# EAGLE design bs_usb (EAGLE 9.2.0)
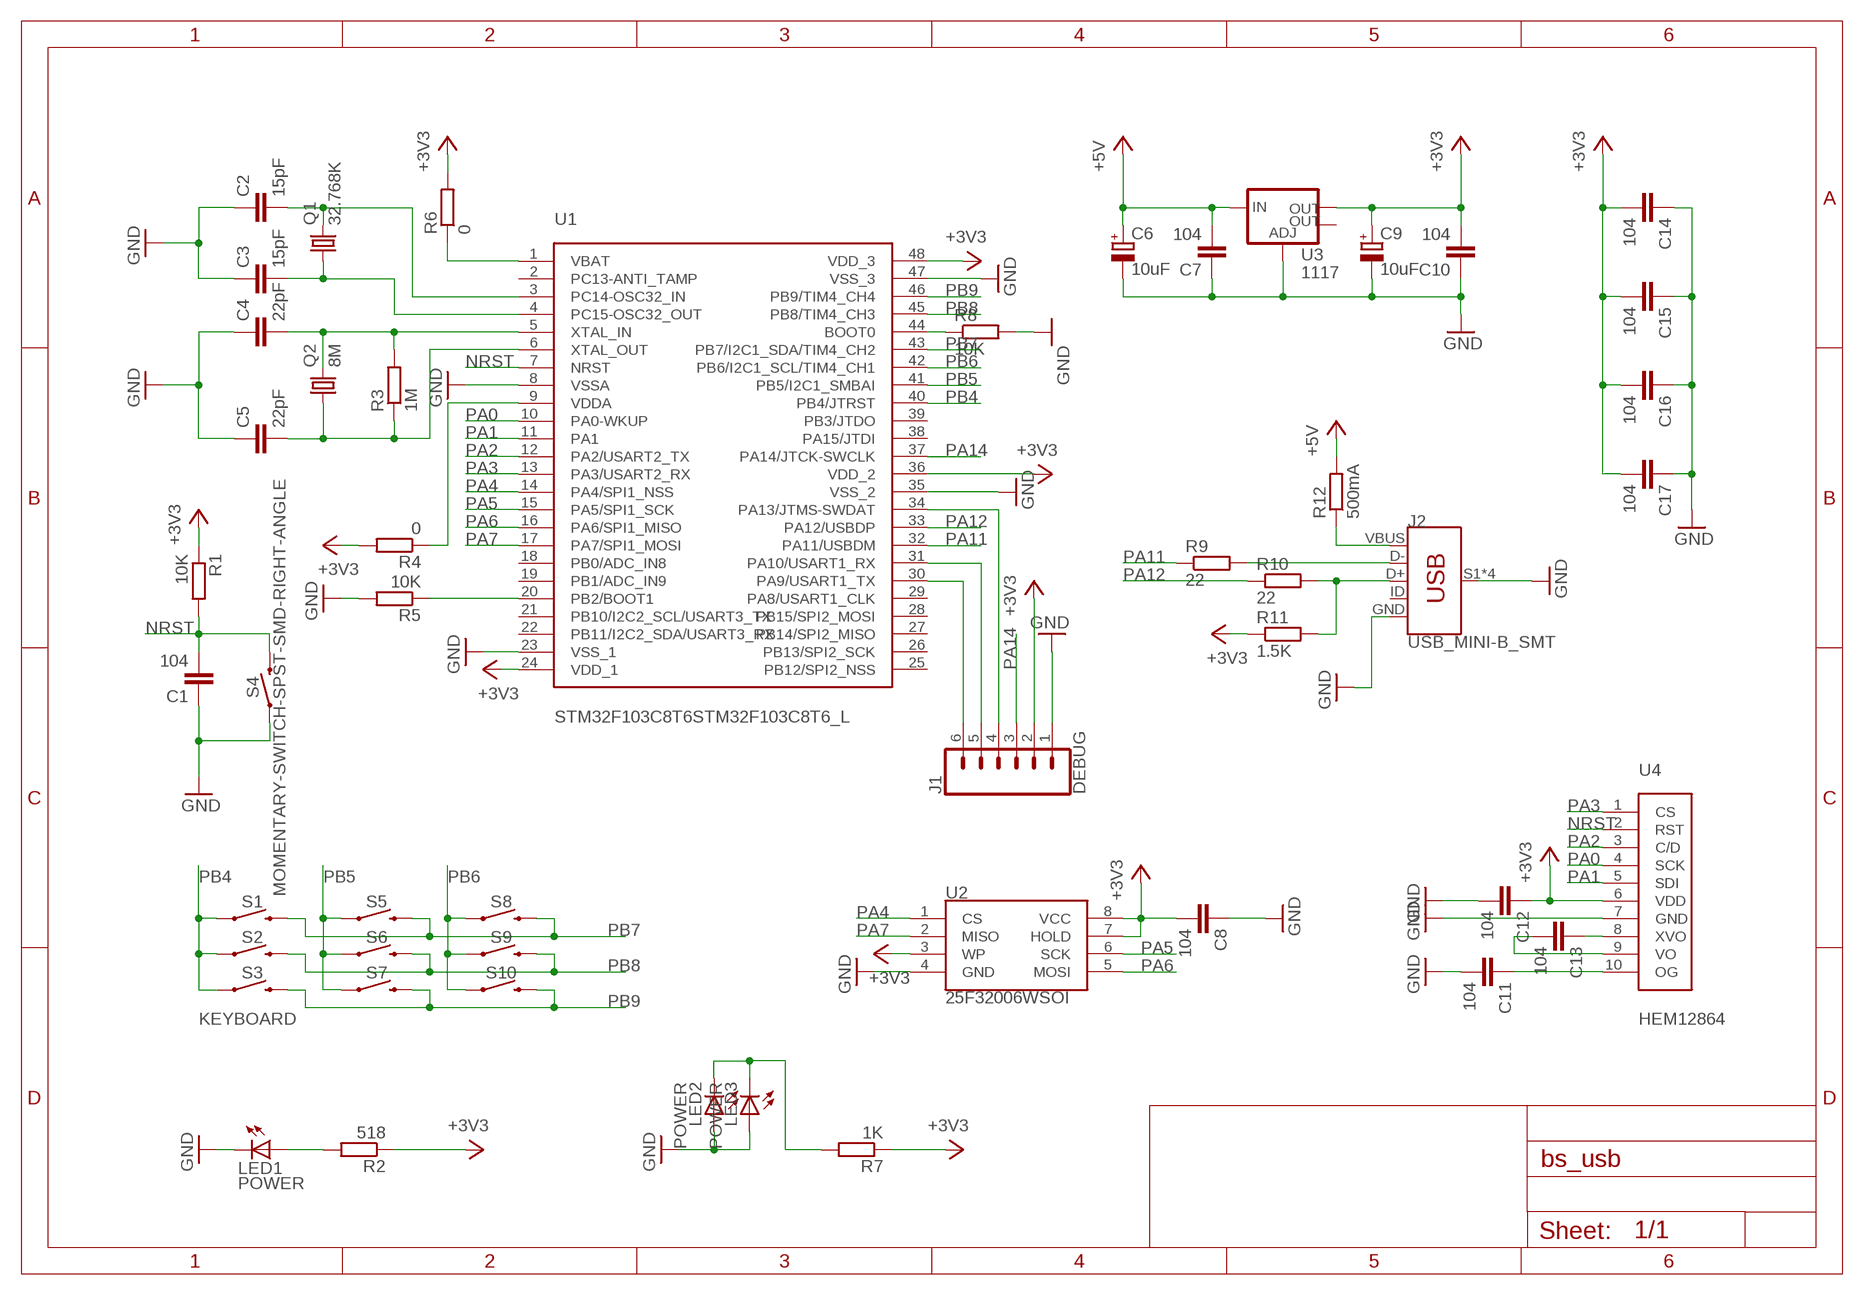
[diagram p0: schematic, sheet 1]

## Parts
C1  104  C-EUC0603  [C0603]
C2  15pF  C-EUC0603  [C0603]
C3  15pF  C-EUC0603  [C0603]
C4  22pF  C-EUC0603  [C0603]
C5  22pF  C-EUC0603  [C0603]
C6  10uF  CPOL-EUA/3216-18R  [A/3216-18R]
C7  104  C-EUC0603  [C0603]
C8  104  C-EUC0603  [C0603]
C9  10uF  CPOL-EUA/3216-18R  [A/3216-18R]
C10  104  C-EUC0603  [C0603]
C11  104  C-EUC0603  [C0603]
C12  104  C-EUC0603  [C0603]
C13  104  C-EUC0603  [C0603]
C14  104  C-EUC0603  [C0603]
C15  104  C-EUC0603  [C0603]
C16  104  C-EUC0603  [C0603]
C17  104  C-EUC0603  [C0603]
J1  DEBUG  CONN_06NO_SILK_FEMALE_PTH  [1X06_NO_SILK]
J2  USB_MINI-B_SMT  [USB-MINIB]
LED1  POWER  LEDCHIP-LED0805  [CHIP-LED0805]
LED2  POWER  LEDCHIP-LED0805  [CHIP-LED0805]
LED3  POWER  LEDCHIP-LED0805  [CHIP-LED0805]
Q1  32.768K  CRYSTALTC26H  [TC26H]
Q2  8M  CRYSTALSM49  [SM49]
R1  10K  R-EU_R0603  [R0603]
R2  518  R-EU_R0603  [R0603]
R3  1M  R-EU_R0603  [R0603]
R4  0  R-EU_R0603  [R0603]
R5  10K  R-EU_R0603  [R0603]
R6  0  R-EU_R0603  [R0603]
R7  1K  R-EU_R0603  [R0603]
R8  10K  R-EU_R0603  [R0603]
R9  22  R-EU_R0603  [R0603]
R10  22  R-EU_R0603  [R0603]
R11  1.5K  R-EU_R0603  [R0603]
R12  500mA  R-EU_R0603  [R0603]
S1  MOMENTARY-SWITCH-SPST-PTH-6.0MM  [TACTILE_SWITCH_PTH_6.0MM]
S2  MOMENTARY-SWITCH-SPST-PTH-6.0MM  [TACTILE_SWITCH_PTH_6.0MM]
S3  MOMENTARY-SWITCH-SPST-PTH-6.0MM  [TACTILE_SWITCH_PTH_6.0MM]
S4  MOMENTARY-SWITCH-SPST-SMD-RIGHT-ANGLE  [TACTILE_SWITCH_SMD_RIGHT_ANGLE]
S5  MOMENTARY-SWITCH-SPST-PTH-6.0MM  [TACTILE_SWITCH_PTH_6.0MM]
S6  MOMENTARY-SWITCH-SPST-PTH-6.0MM  [TACTILE_SWITCH_PTH_6.0MM]
S7  MOMENTARY-SWITCH-SPST-PTH-6.0MM  [TACTILE_SWITCH_PTH_6.0MM]
S8  MOMENTARY-SWITCH-SPST-PTH-6.0MM  [TACTILE_SWITCH_PTH_6.0MM]
S9  MOMENTARY-SWITCH-SPST-PTH-6.0MM  [TACTILE_SWITCH_PTH_6.0MM]
S10  MOMENTARY-SWITCH-SPST-PTH-6.0MM  [TACTILE_SWITCH_PTH_6.0MM]
U1  STM32F103C8T6STM32F103C8T6_L  [TQFP48_7X7]
U2  25F32006WSOI  SPI_FLASH-X25XXSMD1  [SO08-EIAJ]
U3  1117  V_REG_LM1117SOT223  [SOT223]
U4  HEM12864  [HEM12864]

## Nets
+3V3: C8.2 C9.+ C10.2 C12.1 C14.2 C15.2 C16.2 C17.2 J1.2 R1.1 R2.1 R4.2 R6.2 R7.1 R11.1 U1.24(VDD_1) U1.36(VDD_2) U1.48(VDD_3) U2.3(WP) U2.7(HOLD) U2.8(VCC) U3.2(OUT) U4.6(VDD)
+5V: C6.+ C7.2 R12.2 U3.3(IN)
GND: C1.1 C2.1 C3.1 C4.1 C5.1 C6.- C7.1 C8.1 C9.- C10.1 C11.2 C12.2 C14.1 C15.1 C16.1 C17.1 J1.1 J2.GND J2.S1(SHIELD) J2.S2(SHIELD) J2.S3(SHIELD) J2.S4(SHIELD) LED1.C LED2.A LED3.A R5.2 R8.2 S4.1 U1.8(VSSA) U1.23(VSS_1) U1.35(VSS_2) U1.47(VSS_3) U2.4(GND) U3.1(ADJ) U4.7(GND)
N$1: R8.1 U1.44(BOOT0)
N$2: R6.1 U1.1(VBAT)
N$3: R5.1 U1.20(PB2/BOOT1)
N$4: R4.1 U1.9(VDDA)
N$5: C4.2 Q2.2 R3.2 U1.5(XTAL_IN)
N$6: C2.2 Q1.2 U1.3(PC14-OSC32_IN)
N$7: C5.2 Q2.1 R3.1 U1.6(XTAL_OUT)
N$8: C3.2 Q1.1 U1.4(PC15-OSC32_OUT)
N$9: J2.D- R9.2
N$10: J2.D+ R10.2 R11.2
N$11: J2.VBUS R12.1
N$12: J1.6 U1.30(PA9/USART1_TX)
N$13: J1.5 U1.31(PA10/USART1_RX)
N$14: C13.1 U4.8(XVO)
N$15: C13.2 U4.9(VO)
N$16: C11.1 U4.10(OG)
N$18: LED2.C LED3.C R7.2
N$19: LED1.A R2.2
NRST: C1.2 R1.2 S4.2 U1.7(NRST) U4.2(RST)
PA0: U1.10(PA0-WKUP) U4.4(SCK)
PA1: U1.11(PA1) U4.5(SDI)
PA2: U1.12(PA2/USART2_TX) U4.3(C/D)
PA3: U1.13(PA3/USART2_RX) U4.1(CS)
PA4: U1.14(PA4/SPI1_NSS) U2.1(CS)
PA5: U1.15(PA5/SPI1_SCK) U2.6(SCK)
PA6: U1.16(PA6/SPI1_MISO) U2.5(MOSI)
PA7: U1.17(PA7/SPI1_MOSI) U2.2(MISO)
PA11: R9.1 U1.32(PA11/USBDM)
PA12: R10.1 U1.33(PA12/USBDP)
PA13: J1.4 U1.34(PA13/JTMS-SWDAT)
PA14: J1.3 U1.37(PA14/JTCK-SWCLK)
PB4: S1.1 S2.1 S3.1 U1.40(PB4/JTRST)
PB5: S5.1 S6.1 S7.1 U1.41(PB5/I2C1_SMBAI)
PB6: S8.1 S9.1 S10.1 U1.42(PB6/I2C1_SCL/TIM4_CH1)
PB7: S1.3 S5.3 S8.3 U1.43(PB7/I2C1_SDA/TIM4_CH2)
PB8: S2.3 S6.3 S9.3 U1.45(PB8/TIM4_CH3)
PB9: S3.3 S7.3 S10.3 U1.46(PB9/TIM4_CH4)
Unconnected: J2.ID U1.2(PC13-ANTI_TAMP) U1.18(PB0/ADC_IN8) U1.19(PB1/ADC_IN9) U1.21(PB10/I2C2_SCL/USART3_TX) U1.22(PB11/I2C2_SDA/USART3_RX) U1.25(PB12/SPI2_NSS) U1.26(PB13/SPI2_SCK) U1.27(PB14/SPI2_MISO) U1.28(PB15/SPI2_MOSI) U1.29(PA8/USART1_CLK) U1.38(PA15/JTDI) U1.39(PB3/JTDO) U3.4(OUT)

## Notes on the sheet
- KEYBOARD

## Library data of the parts
C1-C5 C7 C8 C10-C17 = rcl:C-EU: CAPACITOR, European symbol; SPICEPREFIX: C
C6 C9 = rcl:CPOL-EU: POLARIZED CAPACITOR, European symbol; SPICEPREFIX: C
J1 = SparkFun-Connectors:CONN_06: Multi connection point. Often used as Generic Header-pin footprint for 0.1 inch spaced/style header connections On any of the 0.1 inch spaced packages, you can populate with these: Break Away Headers - Straight <https://www.sparkfun.com/products/116> (PRT-00116) Break Away Male Headers - Right Angle <https://www.sparkfun.com/products/553> (PRT-00553) Female Headers <https://www.sparkfun.com/products/115> (PRT-00115) Break Away Headers - Machine Pin <https://www.sparkfun.com/products/117> (PRT-00117) Break Away Female Headers - Swiss Machine Pin <https://www.sparkfun.com/products/743> (PRT-00743) Arduino Stackable Header - 6 Pin <https://www.sparkfun.com/products/9280> (PRT-09280) For SCREWTERMINALS and SPRING TERMINALS visit here: Screw Terimnals on SparkFun.com <https://www.sparkfun.com/search/results?term=Screw+Terminals> (5mm/3.5mm/2.54mm spacing) This device is also useful as a general connection point to wire up your design to another part of your project. Our various solder wires solder well into these plated through hole pads. Hook-Up Wire - Assortment (Stranded, 22 AWG) <https://www.sparkfun.com/products/11375> (PRT-11375) Hook-Up Wire - Assortment (Solid Core, 22 AWG) <https://www.sparkfun.com/products/11367> (PRT-11367) View the entire wire category on our website here <https://www.sparkfun.com/categories/141>; PROD_ID: CONN-08437
J2 = SparkFun-Connectors:USB_MINI-B: USB type Mini-B Connector Breaks out 5th pin, and includes shield pins if needed. SparkFun Products: SparkFun FTDI Basic Breakout <https://www.sparkfun.com/products/9716> SparkFun XBee Explorer USB <https://www.sparkfun.com/products/11812> SparkFun Redboard <https://www.sparkfun.com/products/12757>; PROD_ID: CONN-08193; SF_ID: PRT-00587
LED1-LED3 = led:LED: LED OSRAM: - CHIPLED LG R971, LG N971, LY N971, LG Q971, LY Q971, LO R971, LY R971 LH N974, LH R974 LS Q976, LO Q976, LY Q976 LO Q996 - Hyper CHIPLED LW Q18S LB Q993, LB Q99A, LB R99A - SideLED LS A670, LO A670, LY A670, LG A670, LP A670 LB A673, LV A673, LT A673, LW A673 LH A674 LY A675 LS A676, LA A676, LO A676, LY A676, LW A676 LS A679, LY A679, LG A679 - Hyper Micro SIDELED® LS Y876, LA Y876, LO Y876, LY Y876 LT Y87S - SmartLED LW L88C, LW L88S LB L89C, LB L89S, LG L890 LS L89K, LO L89K, LY L89K LS L896, LA L896, LO L896, LY L896 - TOPLED LS T670, LO T670, LY T670, LG T670, LP T670 LSG T670, LSP T670, LSY T670, LOP T670, LYG T670 LG T671, LOG T671, LSG T671 LB T673, LV T673, LT T673, LW T673 LH T674 LS T676, LA T676, LO T676, LY T676, LB T676, LH T676, LSB T676, LW T676 LB T67C, LV T67C, LT T67C, LS T67K, LO T67K, LY T67K, LW E67C LS E67B, LA E67B, LO E67B, LY E67B, LB E67C, LV E67C, LT E67C LW T67C LS T679, LY T679, LG T679 LS T770, LO T770, LY T770, LG T770, LP T770 LB T773, LV T773, LT T773, LW T773 LH T774 LS E675, LA E675, LY E675, LS T675 LS T776, LA T776, LO T776, LY T776, LB T776 LHGB T686 LT T68C, LB T68C - Hyper Mini TOPLED® LB M676 - Mini TOPLED Santana® LG M470 LS M47K, LO M47K, LY M47K Source: http://www.osram.convergy.de LUXEON: - LUMILED® LXK2-PW12-R00, LXK2-PW12-S00, LXK2-PW14-U00, LXK2-PW14-V00 LXK2-PM12-R00, LXK2-PM12-S00, LXK2-PM14-U00 LXK2-PE12-Q00, LXK2-PE12-R00, LXK2-PE12-S00, LXK2-PE14-T00, LXK2-PE14-U00 LXK2-PB12-K00, LXK2-PB12-L00, LXK2-PB12-M00, LXK2-PB14-N00, LXK2-PB14-P00, LXK2-PB14-Q00 LXK2-PR12-L00, LXK2-PR12-M00, LXK2-PR14-Q00, LXK2-PR14-R00 LXK2-PD12-Q00, LXK2-PD12-R00, LXK2-PD12-S00 LXK2-PH12-R00, LXK2-PH12-S00 LXK2-PL12-P00, LXK2-PL12-Q00, LXK2-PL12-R00 Source: www.luxeon.com KINGBRIGHT: KA-3528ASYC Source: www.kingbright.com
Q1 Q2 = crystal:CRYSTAL: CRYSTAL; OC_FARNELL: unknown; OC_NEWARK: unknown
R1-R12 = rcl:R-EU_: RESISTOR, European symbol; SPICEPREFIX: R
S1-S3 S5-S10 = SparkFun-Switches:MOMENTARY-SWITCH-SPST: Momentary Switch (Pushbutton) - SPST Normally-open (NO) SPST momentary switches (buttons, pushbuttons). Variants PTH-12MM - 12mm square, through-hole Momentary Pushbutton Switch - 12mm Square <https://www.sparkfun.com/products/9190> (COM-09190) PTH-6.0MM, PTH-6.0MM-KIT - 6.0mm square, through-hole Mini Pushbutton Switch <https://www.sparkfun.com/products/97> (COM-00097) KIT package intended for soldering kit's - only one side of pads' copper is exposed. PTH-RIGHT-ANGLE-KIT - Right-angle, through-hole Right Angle Tactile Button <https://www.sparkfun.com/products/10791> - Used on SparkFun BigTime Watch Kit <https://www.sparkfun.com/products/11734> SMD-12MM - 12mm square, surface-mount Tactile Button - SMD (12mm) <https://www.sparkfun.com/products/12993> (COM-12993) Used on SparkFun PicoBoard <https://www.sparkfun.com/products/11888> SMD-4.5MM - 4.5mm Square Trackball Switch Used on SparkFun Blackberry Trackballer Breakout <https://www.sparkfun.com/products/13169> SMD-4.6MMX2.8MM - 4.60mm x 2.80mm, surface mount Used on SparkFun SAMD21 Mini Breakout <https://www.sparkfun.com/products/13664> SMD-5.2MM, SMD-5.2-REDUNDANT - 5.2mm square, surface-mount Mini Pushbutton Switch - SMD <https://www.sparkfun.com/products/8720> (COM-08720) Used on Arduino Pro Mini <https://www.sparkfun.com/products/11114> REDUNDANT package connects both switch circuits together SMD-6.0X3.5MM - 6.0 x 3.5mm, surface mount Momentary Reset Switch SMD <https://www.sparkfun.com/products/8229> (COM-08229) SMD-6.2MM-TALL - 6.2mm square, surface mount Tactile Button - SMD (6mm) <https://www.sparkfun.com/products/12992> Used on SparkFun Digital Sandbox <https://www.sparkfun.com/products/12651> SMD-RIGHT-ANGLE - Right-angle, surface mount Used on SparkFun Block for Intel® Edison - Arduino <https://www.sparkfun.com/products/13036>; PROD_ID: SWCH-08441; SF_SKU: COM-00097
S4 = SparkFun-Switches:MOMENTARY-SWITCH-SPST: Momentary Switch (Pushbutton) - SPST Normally-open (NO) SPST momentary switches (buttons, pushbuttons). Variants PTH-12MM - 12mm square, through-hole Momentary Pushbutton Switch - 12mm Square <https://www.sparkfun.com/products/9190> (COM-09190) PTH-6.0MM, PTH-6.0MM-KIT - 6.0mm square, through-hole Mini Pushbutton Switch <https://www.sparkfun.com/products/97> (COM-00097) KIT package intended for soldering kit's - only one side of pads' copper is exposed. PTH-RIGHT-ANGLE-KIT - Right-angle, through-hole Right Angle Tactile Button <https://www.sparkfun.com/products/10791> - Used on SparkFun BigTime Watch Kit <https://www.sparkfun.com/products/11734> SMD-12MM - 12mm square, surface-mount Tactile Button - SMD (12mm) <https://www.sparkfun.com/products/12993> (COM-12993) Used on SparkFun PicoBoard <https://www.sparkfun.com/products/11888> SMD-4.5MM - 4.5mm Square Trackball Switch Used on SparkFun Blackberry Trackballer Breakout <https://www.sparkfun.com/products/13169> SMD-4.6MMX2.8MM - 4.60mm x 2.80mm, surface mount Used on SparkFun SAMD21 Mini Breakout <https://www.sparkfun.com/products/13664> SMD-5.2MM, SMD-5.2-REDUNDANT - 5.2mm square, surface-mount Mini Pushbutton Switch - SMD <https://www.sparkfun.com/products/8720> (COM-08720) Used on Arduino Pro Mini <https://www.sparkfun.com/products/11114> REDUNDANT package connects both switch circuits together SMD-6.0X3.5MM - 6.0 x 3.5mm, surface mount Momentary Reset Switch SMD <https://www.sparkfun.com/products/8229> (COM-08229) SMD-6.2MM-TALL - 6.2mm square, surface mount Tactile Button - SMD (6mm) <https://www.sparkfun.com/products/12992> Used on SparkFun Digital Sandbox <https://www.sparkfun.com/products/12651> SMD-RIGHT-ANGLE - Right-angle, surface mount Used on SparkFun Block for Intel® Edison - Arduino <https://www.sparkfun.com/products/13036>; PROD_ID: COMP-12265
U1 = bs_usb:STM32F103C8T6: STM32F103C8T6
U2 = SparkFun-IC-Memory:SPI_FLASH-X25XX: 32M Serial Flash Memory 8pin SPI Flash series x25xx. Works with devices like W25X32 and BR25L32 Datasheet <http://www.macronix.com/Lists/Datasheet/Attachments/5031/MX25L3206E,%203V,%2032Mb,%20v1.5.pdf> SparkFun Products SparkFun Venus GPS Logger <https://www.sparkfun.com/products/10920> (GPS-10920); PROD_ID: IC-09109
U3 = SparkFun-IC-Power:V_REG_LM1117: Voltage Regulator LM1117 Standard adjustable voltage regulator but in SMD form. Spark Fun Electronics SKU : COM-00595; PROD_ID: VREG-08170
U4 = bs_usb:HEM12864: HEM12864

## Board
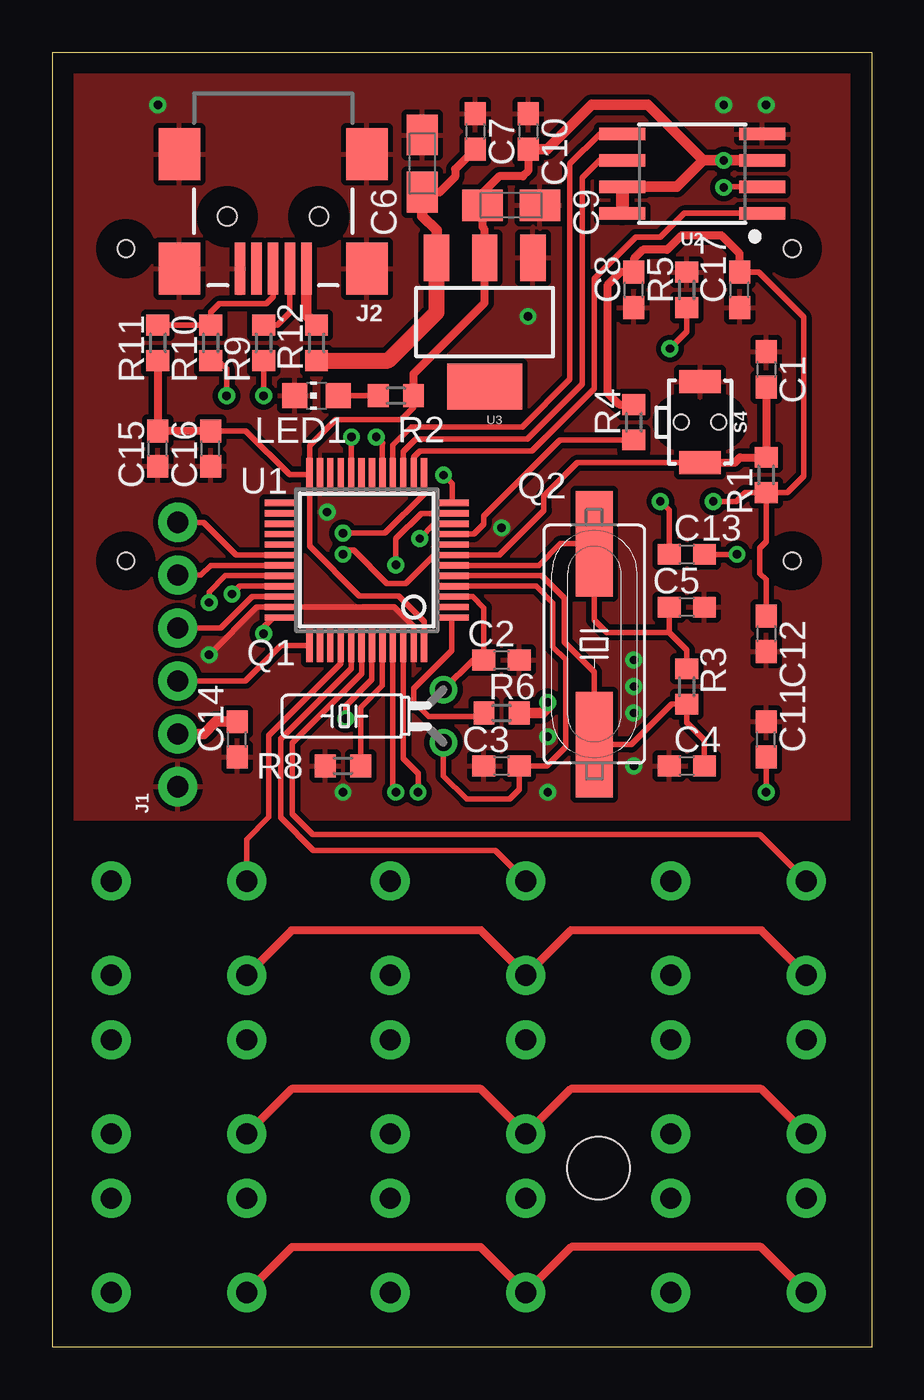
[diagram p1: board, top side]
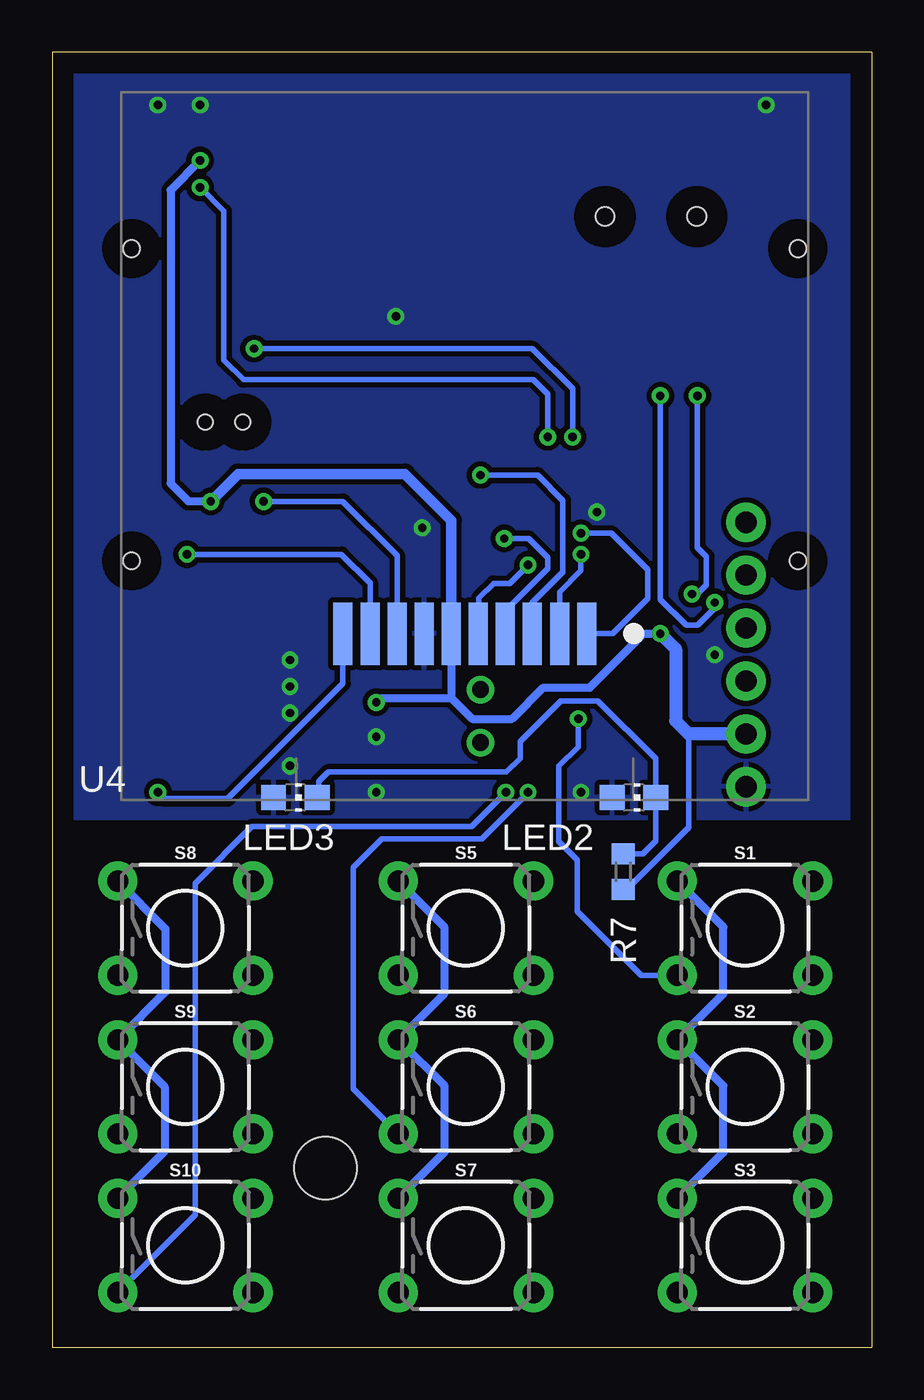
[diagram p2: board, bottom side, seen from below]

Size 39.37 x 62.23 mm. Coordinates in mm from the lower left corner, seen from the top.
Outline: 0,62.23 39.37,62.23 39.37,0 0,0 0,62.23
Copper layers (1*16): Top 0.035mm / dielectric 1.5mm / Bottom 0.035mm
Design rules "default": minimum track width 6mil, minimum drill 0.35mm, track to track 6mil, track to pad 6mil, pad to pad 6mil, via to via 6mil, smd to smd 6mil, copper to edge 40mil, drill to drill 6mil, minimum pad ring 10mil, minimum via ring 8mil, stop-mask expansion 4mil, vias tented up to drill 0mil, thermal gap 10mil
Holes 3 mm at 26.24,8.61

### Footprints (pad centres in the part's own frame; a part is rotated, then mirrored left to right if it is on the bottom)
C0603 = smd 1.1 x 1: 1 -0.85,0; 2 0.85,0
A/3216-18R = smd 1.95 x 1.5: + 1.375,0; - -1.375,0
1X06_NO_SILK = drill 1.016 pad 1.88: 1 0,0; 2 2.54,0; 3 5.08,0; 4 7.62,0; 5 10.16,0; 6 12.7,0
USB-MINIB = smd 2.5 x 0.5: D+ 2.5,0; D- 2.5,0.8; GND 2.5,-1.6; ID 2.5,-0.8; VBUS 2.5,1.6 | smd 2.5 x 2: S1 -3,4.5; S2 2.5,4.5; S3 -3,-4.5; S4 2.5,-4.5 | hole 0.9: 0,2.2; 0,-2.2
CHIP-LED0805 = smd 1.2 x 1.2: A 0,-1.05; C 0,1.05
TC26H = drill 0.813: 1 -1.27,0; 2 1.27,0
SM49 = smd 5.08 x 1.778: 1 -4.826,0; 2 4.826,0
R0603 = smd 1 x 1.1: 1 -0.85,0; 2 0.85,0
TACTILE_SWITCH_PTH_6.0MM = drill 1.016 pad 1.88: 1 -3.251,2.261; 2 3.251,2.261; 3 -3.251,-2.261; 4 3.251,-2.261
TACTILE_SWITCH_SMD_RIGHT_ANGLE = smd 1.1 x 2: 1 -1.95,0; 2 1.95,0 | hole 0.7: 0,0.9; 0,-0.9
TQFP48_7X7 = smd 0.3 x 1.6: 1 -2.75,-4.1; 2 -2.25,-4.1; 3 -1.75,-4.1; 4 -1.25,-4.1; 5 -0.75,-4.1; 6 -0.25,-4.1; 7 0.25,-4.1; 8 0.75,-4.1; 9 1.25,-4.1; 10 1.75,-4.1; 11 2.25,-4.1; 12 2.75,-4.1; 25 2.75,4.1; 26 2.25,4.1; 27 1.75,4.1; 28 1.25,4.1; 29 0.75,4.1; 30 0.25,4.1; 31 -0.25,4.1; 32 -0.75,4.1; 33 -1.25,4.1; 34 -1.75,4.1; 35 -2.25,4.1; 36 -2.75,4.1 | smd 1.6 x 0.3: 13 4.1,-2.75; 14 4.1,-2.25; 15 4.1,-1.75; 16 4.1,-1.25; 17 4.1,-0.75; 18 4.1,-0.25; 19 4.1,0.25; 20 4.1,0.75; 21 4.1,1.25; 22 4.1,1.75; 23 4.1,2.25; 24 4.1,2.75; 37 -4.1,2.75; 38 -4.1,2.25; 39 -4.1,1.75; 40 -4.1,1.25; 41 -4.1,0.75; 42 -4.1,0.25; 43 -4.1,-0.25; 44 -4.1,-0.75; 45 -4.1,-1.25; 46 -4.1,-1.75; 47 -4.1,-2.25; 48 -4.1,-2.75
SO08-EIAJ = smd 0.61 x 2.21: 1 -1.905,-3.378; 2 -0.635,-3.378; 3 0.635,-3.378; 4 1.905,-3.378; 5 1.905,3.353; 6 0.635,3.353; 7 -0.635,3.353; 8 -1.905,3.353
SOT223 = smd 1.219 x 2.235: 1 -2.311,-3.099; 2 0,-3.099; 3 2.311,-3.099 | smd 3.6 x 2.2: 4 0,3.099
HEM12864 = smd 0.914 x 2.997: 1 11.7,0; 2 10.4,0; 3 9.1,0; 4 7.8,0; 5 6.5,0; 6 5.2,0; 7 3.9,0; 8 2.6,0; 9 1.3,0; 10 0,0 | hole 0.8: -10.15,18.5; -10.15,3.5; 21.85,18.5; 21.85,3.5

### Placement (x,y rotation side)
C1  34.29,46.99 270 top
C2  21.59,33.02 180 top
C3  21.59,27.94 0 top
C4  30.48,27.94 0 top
C5  30.48,35.56 180 top
C6  17.78,56.87 270 top
C7  20.32,58.42 270 top
C8  27.94,50.8 90 top
C9  22.05,54.86 180 top
C10  22.86,58.42 270 top
C11  34.29,29.21 90 top
C12  34.29,34.29 270 top
C13  30.48,38.1 0 top
C14  8.89,29.21 90 top
C15  5.08,43.18 90 top
C16  7.62,43.18 90 top
C17  33.02,50.8 90 top
J1  6.04,26.94 90 top
J2  10.62,54.33 270 top
LED1  12.7,45.72 90 top
LED2  11.43,26.42 270 bottom
LED3  27.69,26.42 270 bottom
Q1  18.8,30.33 90 top
Q2  26.04,33.78 270 top
R1  34.29,41.91 90 top
R2  16.51,45.72 180 top
R3  30.48,31.75 270 top
R4  27.94,44.45 90 top
R5  30.48,50.8 90 top
R6  21.59,30.48 0 top
R7  11.94,22.86 90 bottom
R8  13.97,27.94 180 top
R9  10.16,48.26 90 top
R10  7.62,48.26 90 top
R11  5.08,48.26 90 top
R12  12.7,48.26 270 top
S1  6.1,20.14 0 bottom
S2  6.1,12.52 0 bottom
S3  6.1,4.9 0 bottom
S4  31.11,44.45 270 top
S5  19.5,20.14 0 bottom
S6  19.5,12.52 0 bottom
S7  19.5,4.9 0 bottom
S8  32.97,20.14 0 bottom
S9  32.97,12.52 0 bottom
S10  32.97,4.9 0 bottom
U1  15.11,37.82 90 top
U2  30.73,56.39 90 top
U3  20.78,49.25 180 top
U4  25.4,34.29 0 bottom

### Tracks (layer width: path | path; a pad name or v marks a point on that pad's centre or on a via)
+3V3  (via drill 0.4)
  Top 0.254: v31.75,40.64 32.87,40.64 33.29,41.06 R1.1 | C16.2 9.31,44.03 11.42,41.92 U1.24 | v10.16,34.29 10.16,34.62 10.61,35.07 U1.36 | C17.2 33.95,51.65 36.09,49.51 36.09,41.86 35.29,41.06 R1.1 | R1.1 34.29,38.71 33.98,38.41 33.98,37.19 34.29,36.88 C12.1 | R2.1 17.36,45.17 16.76,44.58 13.61,44.58 12.36,43.33 U1.24 | U1.48 17.86,34.87 16.64,36.09 14.76,36.09 12.36,38.49 U1.24
  Top 0.381: R2.1 17.36,46.77 20.78,50.19 U3.2 20.78,53.72 20.67,53.83 C9.+ 20.67,55.47 21.46,56.26 22.61,56.26 22.86,56.52 C10.2 | C17.2 33.02,52.55 32.16,53.42 30.23,53.42 29.54,52.73 28.37,52.73 27.94,52.3 C8.2 27.29,51.65 26.67,51.03 26.67,45.87 27.24,45.3 R4.2 | C16.2 C15.2 R11.1
  Top 0.508: J1.2 7.28,29.48 7.86,30.06 C14.2 | C10.2 23.79,57.57 25.91,59.69 28.6,59.69 31.27,57.02 | R6.2 23.57,30.48 23.8,30.71 v23.8,30.99 | U2.7 30,55.75 31.27,57.02 | 31.27,57.02 v32.26,57.02 U2.3
  Top 0.635: U2.7 U2.8
  Bottom 0.254: R7.1 11.77,22.01 8.8,24.98 8.8,29.48
  Bottom 0.381: v31.75,40.64 32.82,40.64 33.68,41.5 33.68,55.6 v32.26,57.02 | U4.6 20.2,31.2 | 20.2,31.2 19.2,30.2 17.27,30.2 15.77,31.7 13.54,31.7 10.95,34.29 v10.16,34.29 | v23.8,30.99 23.59,31.2 20.2,31.2
  Bottom 0.508: v31.75,40.64 30.43,41.96 22.43,41.96 20.2,39.73 U4.6
  Bottom 0.635: J1.2 8.8,29.48 9.42,30.1 9.42,33.55 v10.16,34.29
+5V
  Top 0.381: C6.+ 18.62,55.5 19.36,56.24 19.36,56.6 C7.2
  Top 0.508: C6.+ 17.78,54.36 18.47,53.67 U3.3
  Top 0.762: R12.2 16.14,47.41 18.47,49.73 U3.3
GND  (via drill 0.4)
  Top 0.254: U1.47 17.36,34.64 16.43,35.57 U1.35 9.84,35.57 v7.54,33.27
  other vias: 27.94,27.94 13.97,26.67 23.8,29.34 5.08,59.69 34.29,59.69 32.26,59.69 27.94,33.02 27.94,31.75 27.94,30.48 23.8,26.67 22.86,49.53 13.21,40.13 21.59,39.37
  pour Top (isolate 0.254): 0,62.23 0,25.4 39.37,25.4 39.37,62.23
  pour Bottom (isolate 0.254): 0,62.23 0,25.4 39.37,25.4 39.37,62.23
N$1
  Top 0.254: R8.1 14.82,30.75 15.86,31.79 U1.44
N$2
  Top 0.254: R6.1 20.56,30.3 18.09,30.3 17.37,31.01 17.37,31.66 19.2,33.49 U1.1
N$3  (via drill 0.4)
  Top 0.254: R5.1 30.48,48.79 v29.67,47.98 | U1.20 14.36,43.52 v14.38,43.74
  Bottom 0.254: v29.67,47.98 16.31,47.98 14.38,46.05 v14.38,43.74
N$4
  Top 0.254: R4.1 24.38,43.6 20.73,39.95 20.73,39.55 20.25,39.07 U1.9
N$5
  Top 0.254: C4.2 31.33,29.17 30.48,30.02 R3.2 29.76,30.9 27.81,28.96 Q2.2 26.04,32.44 24.59,33.88 24.59,35.99 23.51,37.07 U1.5
N$6
  Top 0.254: U1.3 20.19,36.07 20.74,35.52 C2.2 20.22,33.02 Q1.2
N$7
  Top 0.254: C5.2 29.63,34.35 | R3.1 30.48,33.5 29.63,34.35 | 29.63,34.35 26.63,34.35 26.04,34.95 Q2.1 24.4,38.61 23.36,37.57 U1.6
N$8
  Top 0.254: U1.4 23.25,36.57 24.05,35.76 24.05,33.65 24.66,33.04 24.66,28.85 23.75,27.94 C3.2 22.44,26.81 21.97,26.34 19.91,26.34 18.8,27.46 Q1.1
N$9
  Top 0.254: J2.D- 11.42,49.72 10.81,49.11 R9.2
N$10
  Top 0.254: J2.D+ 10.62,50.47 10.29,50.14 8.03,50.14 7.62,49.73 R10.2 R11.2
N$11
  Top 0.508: J2.VBUS 12.22,49.59 R12.1
N$12
  Top 0.254: J1.6 7.28,39.64 8.84,38.07 U1.30
N$13
  Top 0.254: J1.5 7.15,37.1 7.62,37.57 U1.31
N$14  (via drill 0.4)
  Top 0.254: C13.1 29.63,40.22 v29.21,40.64
  Bottom 0.254: v29.21,40.64 25.4,40.64 22.8,38.04 U4.8
N$15  (via drill 0.4)
  Top 0.254: C13.2 v32.89,38.1
  Bottom 0.254: v32.89,38.1 25.48,38.1 24.1,36.72 U4.9
N$16  (via drill 0.4)
  Top 0.254: C11.1 v34.29,26.67
  Bottom 0.254: v34.29,26.67 33.98,26.36 30.94,26.36 25.4,31.9 U4.10
N$18
  Bottom 0.254: LED3.C 26.57,26.48 26.57,27.18 26.11,27.64 17.55,27.64 16.89,28.3 16.89,29.11 14.94,31.06 13.16,31.06 10.38,28.29 LED2.C 10.38,24.34 11.01,23.71 R7.2
N$19
  Top 0.254: R2.2 LED1.A
NRST  (via drill 0.4)
  Top 0.254: S4.2 25.23,42.5 23.62,40.89 23.62,40.21 21.48,38.07 U1.7 18.36,38.07 16.99,36.7 16.08,36.7 14.48,38.3 14.17,38.3 v13.97,38.1
  Top 0.381: C1.2 R1.2 33.03,42.76 32.77,42.5 S4.2
  Bottom 0.254: U4.2 15,36.28 13.97,37.31 v13.97,38.1
PA0  (via drill 0.4)
  Top 0.254: U1.10 18.36,39.57 v17.65,38.86
  Bottom 0.254: U4.4 17.6,35.38 15.57,37.41 15.57,37.95 16.49,38.86 v17.65,38.86
PA1  (via drill 0.4)
  Top 0.254: v16.51,37.59 16.51,38.86 17.72,40.07 U1.11
  Bottom 0.254: v16.51,37.59 17.4,36.7 18.16,36.7 18.87,35.99 18.87,34.32 U4.5
PA2  (via drill 0.4)
  Top 0.254: U1.12 19.21,41.49 v18.8,41.91
  Bottom 0.254: U4.3 16.3,35.8 14.84,37.26 14.84,40.69 16.05,41.91 v18.8,41.91
PA3  (via drill 0.4)
  Top 0.254: U1.13 17.86,41 15.98,39.12 v13.97,39.12
  Bottom 0.254: U4.1 12.45,34.29 10.77,35.97 10.77,37.36 12.52,39.12 v13.97,39.12
PA4
  Top 0.254: U1.14 17.36,42.77 17.65,43.05 23.03,43.05 26.04,46.06 26.04,51.33 28.04,53.34 29.21,53.34 30.35,54.48 U2.1
PA5
  Top 0.254: U1.15 16.86,43.05 17.46,43.64 22.81,43.64 25.45,46.28 25.45,56.19 26.29,57.02 U2.6
PA6
  Top 0.254: U1.16 16.36,43.34 17.25,44.22 22.58,44.22 24.87,46.51 24.87,56.87 26.29,58.29 U2.5
PA7  (via drill 0.4)
  Top 0.254: v15.57,43.74 15.87,43.44 15.86,43.43 U1.17 | U2.2 32.28,55.75 v32.26,55.73
  Bottom 0.254: v15.57,43.74 15.57,45.8 16.26,46.48 30.18,46.48 31.11,47.42 31.11,54.59 v32.26,55.73
PA11  (via drill 0.4)
  Top 0.254: R9.1 v10.16,45.72 | v7.54,35.79 7.54,36.3 8.32,37.07 U1.32
  Bottom 0.254: v10.16,45.72 10.16,35.94 8.91,34.7 8.36,34.7 7.54,35.51 v7.54,35.79
PA12  (via drill 0.4)
  Top 0.254: v8.64,36.2 9.01,36.57 U1.33 | R10.1 7.99,47.41 8.38,47.02 v8.38,45.72
  Bottom 0.254: v8.64,36.2 8.38,36.2 7.95,36.63 7.95,38 8.38,38.43 v8.38,45.72
PA13
  Top 0.254: U1.34 9.6,36.07 8.09,34.56 J1.4
PA14
  Top 0.254: J1.3 9.29,32.02 10.99,33.72 U1.37
PB4
  Top 0.254: S1.1 9.35,24.41 10.41,25.48 10.41,29.4 13.86,32.85 U1.40
  Bottom 0.381: S1.1 7.14,20.19 7.14,16.99 S2.1 7.14,12.57 7.14,9.37 S3.1
PB5
  Top 0.254: S5.1 21.28,23.88 12.55,23.88 10.97,25.45 10.97,29.26 11.01,29.26 14.36,32.61 U1.41
  Bottom 0.381: S5.1 20.52,20.18 20.52,17.01 S6.1 20.52,12.56 20.52,9.39 S7.1
PB6
  Top 0.254: U1.42 14.86,32.36 11.53,29.03 11.53,25.63 12.52,24.64 33.98,24.64 S8.1
  Bottom 0.381: S8.1 33.93,20.12 33.93,17.07 S9.1 33.96,12.52 33.96,9.42 S10.1
PB7  (via drill 0.4)
  Top 0.254: U1.43 15.36,32.08 14.1,30.81 v14.1,30.2
  Top 0.381: S1.3 11.51,20.04 20.59,20.04 S5.3 24.91,20.04 34.06,20.04 S8.3
  Bottom 0.254: v14.1,30.2 14.1,28.85 15.03,27.92 15.03,24.3 14.15,23.42 14.15,20.95 11.07,17.88 S1.3
PB8  (via drill 0.4)
  Top 0.254: U1.45 16.36,26.82 v16.51,26.67
  Top 0.381: S2.3 11.51,12.42 20.59,12.42 S6.3 24.91,12.42 34.06,12.42 S9.3
  Bottom 0.254: S6.3 24.92,12.43 24.92,23.06 23.55,24.43 18.75,24.43 v16.51,26.67
PB9  (via drill 0.4)
  Top 0.254: v17.58,26.67 17.58,27.58 16.86,28.3 U1.46
  Top 0.381: S3.3 11.53,4.83 20.57,4.83 S7.3 24.94,4.83 34.04,4.83 S10.3
  Bottom 0.254: S10.3 32.49,6.38 32.49,22.3 29.77,25.02 19.23,25.02 v17.58,26.67